# Altium schematic sheet sensor_board.SchDoc
size A4; SheetNumber: 6; SheetTotal: 7
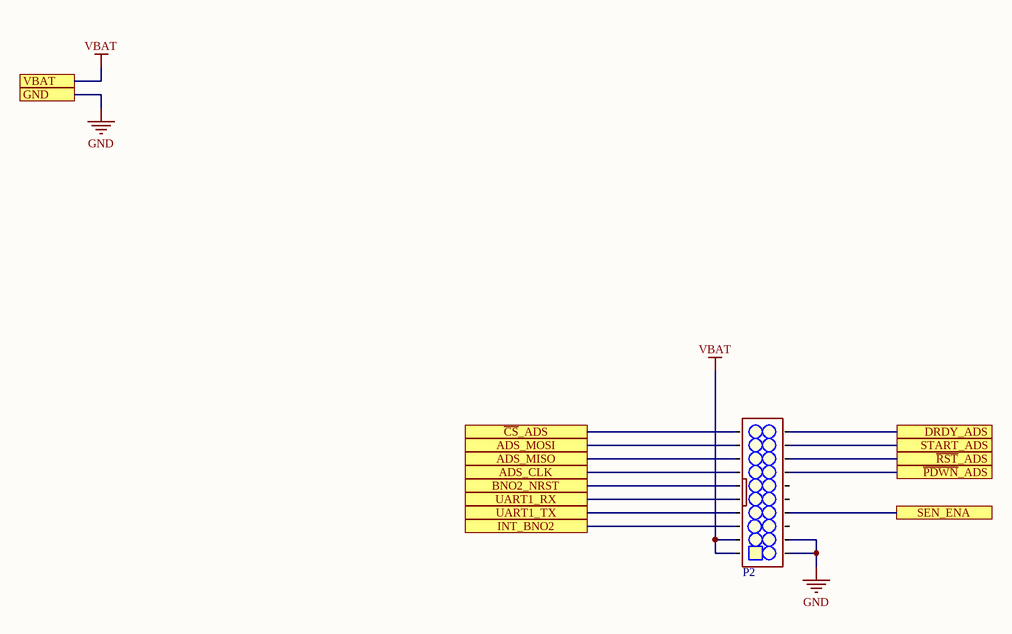
[diagram p0: sensor_board.SchDoc]

## Parts
P2  2x10 Ribbon Header  [2x10_RIBBON_CABLE_CON]  (value not drawn)

## Ports
ADS_CLK, ADS_MISO, ADS_MOSI, BNO2_NRST, DRDY_ADS, GND, INT_BNO2, SEN_ENA, START_ADS, UART1_RX, UART1_TX, VBAT, ~{CS}_ADS, ~{PDWN}_ADS, ~{RST}_ADS

## Nets
GND: P2.19 P2.20 ; port GND
VBAT: P2.1 P2.2 ; port VBAT
ADS_CLK: P2.7 ; port ADS_CLK
ADS_MISO: P2.8 ; port ADS_MISO
ADS_MOSI: P2.9 ; port ADS_MOSI
BNO2_NRST: P2.6 ; port BNO2_NRST
~{CS}_ADS: P2.10 ; port ~{CS}_ADS
DRDY_ADS: P2.11 ; port DRDY_ADS
INT_BNO2: P2.3 ; port INT_BNO2
~{PDWN}_ADS: P2.14 ; port ~{PDWN}_ADS
~{RST}_ADS: P2.13 ; port ~{RST}_ADS
SEN_ENA: P2.17 ; port SEN_ENA
START_ADS: P2.12 ; port START_ADS
UART1_RX: P2.5 ; port UART1_RX
UART1_TX: P2.4 ; port UART1_TX

Not connected (* = marked no-connect by the designer): P2 15 16 18

## Library data of the parts
P2 = 2x10 Ribbon Header: 2.54 mm; Manufacturer Part No: 302-S201; Value: 2x10 Pin Header